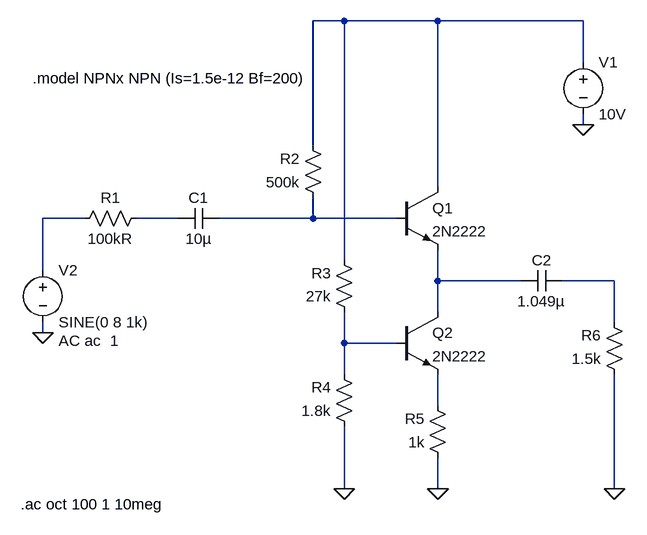
[diagram p0: schematic ss2010.asc]
ss2010.asc, the LTspice schematic file:
Version 4
SHEET 1 880 680
WIRE -16 -208 -64 -208
WIRE 128 -208 -16 -208
WIRE 352 -208 128 -208
WIRE 352 -144 352 -208
WIRE 352 -48 352 -64
WIRE -64 -16 -64 -208
WIRE 128 48 128 -208
WIRE -416 96 -480 96
WIRE -272 96 -336 96
WIRE -64 96 -64 64
WIRE -64 96 -208 96
WIRE 64 96 -64 96
WIRE -16 160 -16 -208
WIRE -480 176 -480 96
WIRE 128 192 128 144
WIRE 256 192 128 192
WIRE 400 192 320 192
WIRE 128 240 128 192
WIRE 400 256 400 192
WIRE -480 272 -480 256
WIRE -16 288 -16 240
WIRE 64 288 -16 288
WIRE -16 336 -16 288
WIRE 128 384 128 336
WIRE -16 512 -16 416
WIRE 128 512 128 464
WIRE 400 512 400 336
FLAG 352 -48 0
FLAG -480 272 0
FLAG 128 512 0
FLAG -16 512 0
FLAG 400 512 0
SYMBOL voltage 352 -160 R0
SYMATTR InstName V1
SYMATTR Value 10V
SYMBOL npn 64 48 R0
SYMATTR InstName Q1
SYMATTR Value 2N2222
SYMBOL npn 64 240 R0
SYMATTR InstName Q2
SYMATTR Value 2N2222
SYMBOL res -320 80 R90
WINDOW 0 0 56 VBottom 2
WINDOW 3 32 56 VTop 2
SYMATTR InstName R1
SYMATTR Value 100kR
SYMBOL res -48 80 R180
WINDOW 0 36 76 Left 2
WINDOW 3 36 40 Left 2
SYMATTR InstName R2
SYMATTR Value 500k
SYMBOL res 0 256 R180
WINDOW 0 36 76 Left 2
WINDOW 3 36 40 Left 2
SYMATTR InstName R3
SYMATTR Value 27k
SYMBOL res 0 432 R180
WINDOW 0 36 76 Left 2
WINDOW 3 36 40 Left 2
SYMATTR InstName R4
SYMATTR Value 1.8k
SYMBOL res 144 480 R180
WINDOW 0 36 76 Left 2
WINDOW 3 36 40 Left 2
SYMATTR InstName R5
SYMATTR Value 1k
SYMBOL res 416 352 R180
WINDOW 0 36 76 Left 2
WINDOW 3 36 40 Left 2
SYMATTR InstName R6
SYMATTR Value 1.5k
SYMBOL cap -208 80 R90
WINDOW 0 0 32 VBottom 2
WINDOW 3 32 32 VTop 2
SYMATTR InstName C1
SYMATTR Value 10µ
SYMBOL cap 320 176 R90
WINDOW 0 0 32 VBottom 2
WINDOW 3 32 32 VTop 2
SYMATTR InstName C2
SYMATTR Value 1.049µ
SYMBOL voltage -480 160 R0
WINDOW 123 24 124 Left 2
WINDOW 39 0 0 Left 2
SYMATTR InstName V2
SYMATTR Value SINE(0 8 1k)
SYMATTR Value2 AC ac  1
TEXT -496 -120 Left 2 !.model NPNx NPN (Is=1.5e-12 Bf=200)
TEXT -514 536 Left 2 !.ac oct 100 1 10meg

The netlist it stands for:
* ss2010.asc
V1 N001 0 10V
Q1 N001 N004 N005 0 2N2222
Q2 N005 N007 N008 0 2N2222
R1 N003 N002 100kR
R2 N004 N001 500k
R3 N007 N001 27k
R4 0 N007 1.8k
R5 0 N008 1k
R6 0 N006 1.5k
C1 N004 N003 10µ
C2 N006 N005 1.049µ
V2 N002 0 SINE(0 8 1k) AC ac  1
.model NPN NPN
.model PNP PNP
.lib standard.bjt
.model NPNx NPN (Is=1.5e-12 Bf=200)
.ac oct 100 1 10meg
.backanno
.end